# EAGLE design blinkenspiel (EAGLE 5.09)
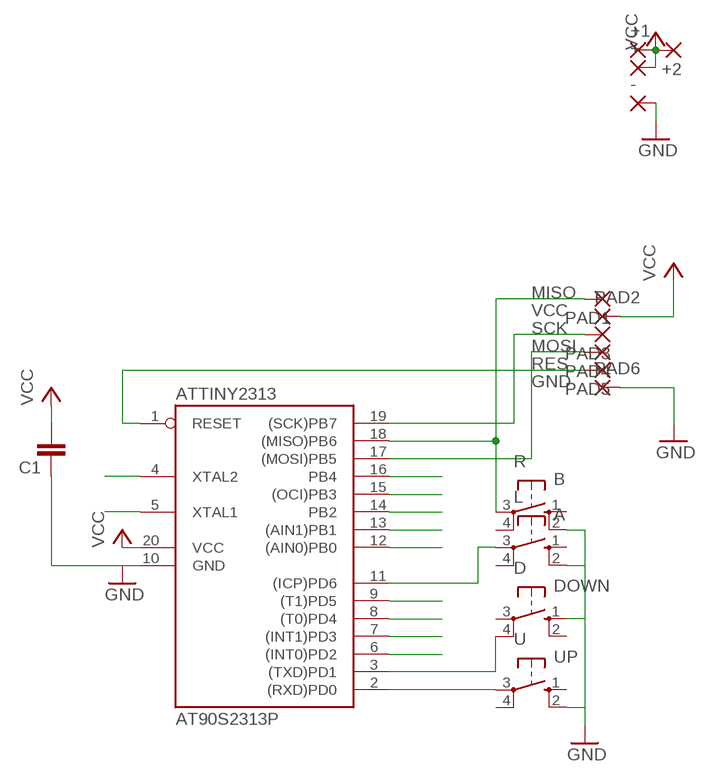
[diagram p0: schematic, sheet 1]

## Parts
+  SMD2  [SMD1,27-2,54]
+1  SMD2  [SMD1,27-2,54]
+2  SMD2  [SMD1,27-2,54]
-  SMD2  [SMD1,27-2,54]
ATTINY2313  AT90S2313P  [DIL20]
C1  C-EU025-024X044  [C025-024X044]
D  DOWN  10-XX  [B3F-10XX]
L  A  10-XX  [B3F-10XX]
PAD1  SMD2  [SMD1,27-2,54]
PAD2  SMD2  [SMD1,27-2,54]
PAD3  SMD2  [SMD1,27-2,54]
PAD4  SMD2  [SMD1,27-2,54]
PAD5  SMD2  [SMD1,27-2,54]
PAD6  SMD2  [SMD1,27-2,54]
R  B  10-XX  [B3F-10XX]
U  UP  10-XX  [B3F-10XX]

## Nets
4: ATTINY2313.4(XTAL2)
5: ATTINY2313.5(XTAL1)
6: ATTINY2313.6((INT0)PD2)
7: ATTINY2313.7((INT1)PD3)
8: ATTINY2313.8((T0)PD4)
9: ATTINY2313.9((T1)PD5)
12: ATTINY2313.12((AIN0)PB0)
13: ATTINY2313.13((AIN1)PB1)
14: ATTINY2313.14(PB2)
15: ATTINY2313.15((OCI)PB3)
16: ATTINY2313.16(PB4)
17: ATTINY2313.17((MOSI)PB5) PAD4.1(P)
GND: -.1(P) ATTINY2313.10(GND) C1.1 D.1(S) L.2(S1) PAD6.1(P) R.2(S1) U.2(S1)
N$1: ATTINY2313.11((ICP)PD6) L.3(P)
N$2: ATTINY2313.3((TXD)PD1) D.4(P1)
N$3: ATTINY2313.2((RXD)PD0) U.3(P)
N$4: ATTINY2313.18((MISO)PB6) PAD1.1(P) R.3(P)
N$7: ATTINY2313.19((SCK)PB7) PAD3.1(P)
RES: ATTINY2313.1(RESET) PAD5.1(P)
VCC: +1.1(P) +2.1(P) +.1(P) ATTINY2313.20(VCC) C1.2 PAD2.1(P)
Unconnected: D.2(S1) D.3(P) L.1(S) L.4(P1) R.1(S) R.4(P1) U.1(S) U.4(P1)

## Notes on the sheet
- MISO
- VCC
- SCK
- MOSI
- RES
- GND

## Library data of the parts
+ +1 +2 - PAD1-PAD6 = wirepad:SMD2: SMD PAD
ATTINY2313 = atmel:AT90S2313: MICROCONTROLLER 2 Kbytes FLASH 128 bytes SRAM 128 bytes EEPROM UART
C1 = resistor:C-EU: CAPACITOR, European symbol
D L R U = switch-omron:10-XX: OMRON SWITCH

## Board
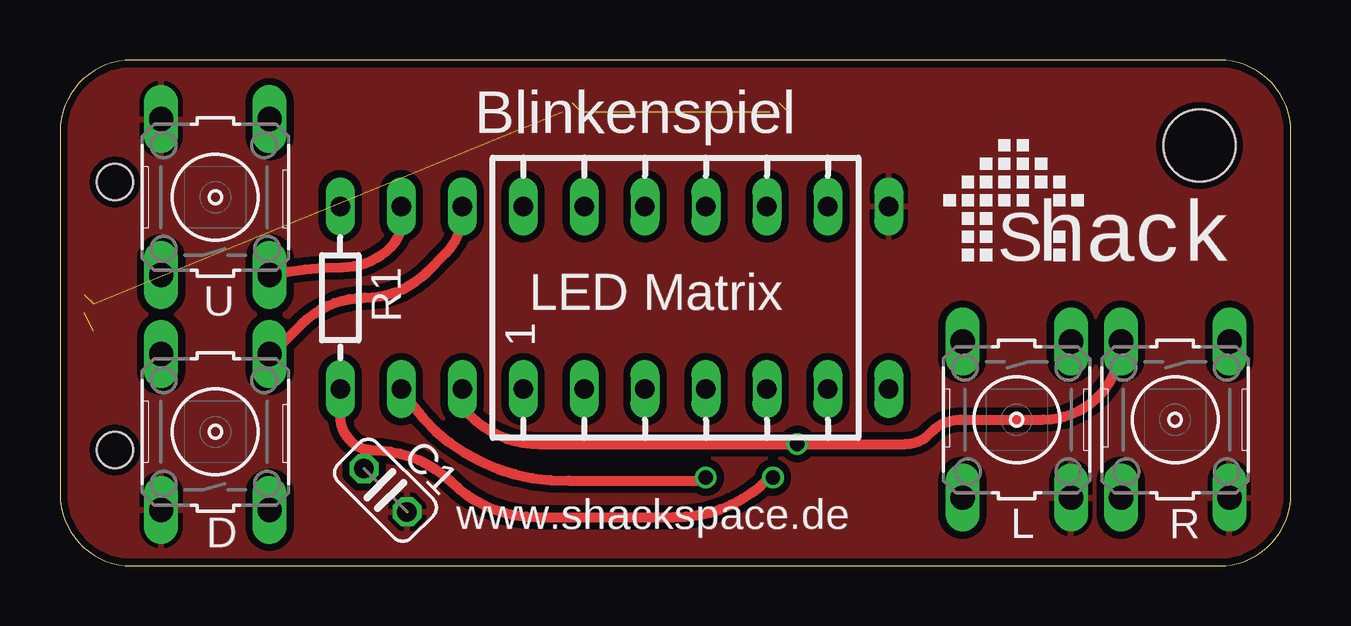
[diagram p1: board, top side]
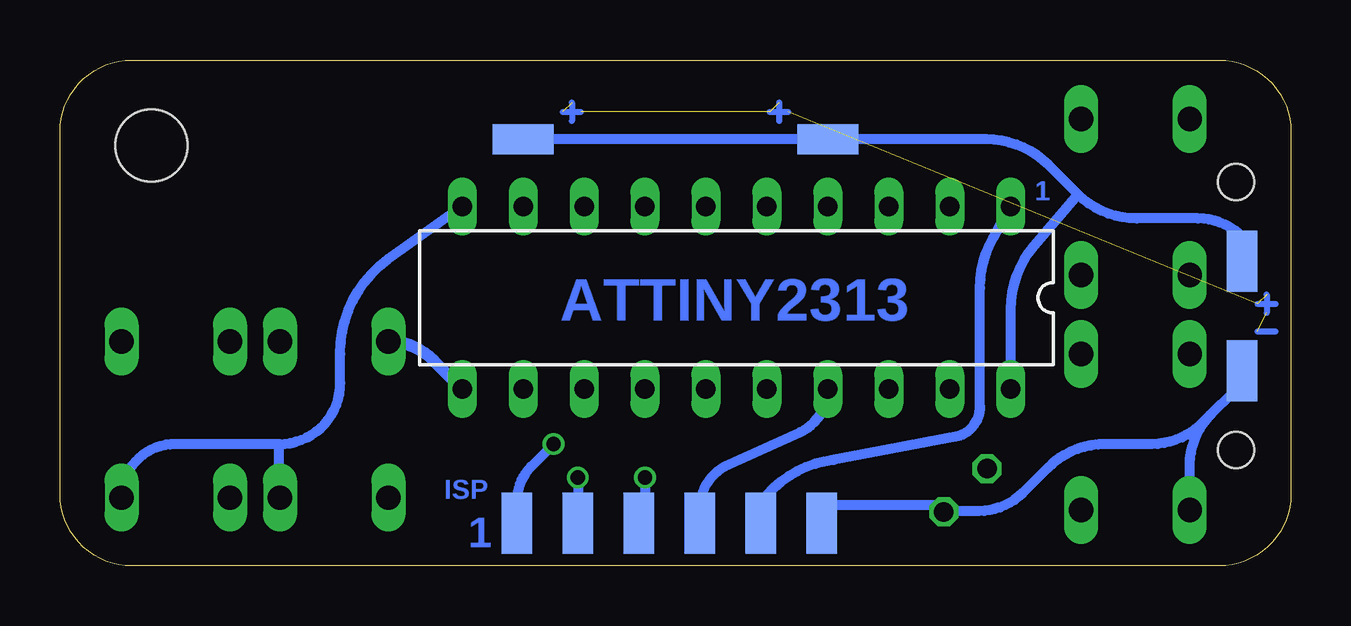
[diagram p2: board, bottom side, seen from below]

Size 51.31 x 21.08 mm. Coordinates in mm from the lower left corner, seen from the top.
Outline: 3,21.08 arc90 0,18.08 0,3 arc90 3,0 48.31,0 arc90 51.31,3 51.31,18.08 arc90 48.31,21.08 3,21.08
Copper layers (1*16): Top 0.035mm / dielectric 1.5mm / Bottom 0.035mm
Design rules "PCB-POOL Standard": minimum track width 0.15mm, minimum drill 0.3mm, track to track 0.15mm, track to pad 0.15mm, pad to pad 0.15mm, via to via 0.15mm, smd to smd 0.15mm, copper to edge 0.3mm, drill to drill 0.2mm, minimum pad ring 0.2mm, minimum via ring 0.15mm, stop-mask expansion 0.075mm, vias tented up to drill 0mil, thermal gap 0.2mm
Holes 3 mm at 47.5,17.53
Holes 1.5 mm at 2.29,4.83 2.29,16
Milling: 8 lines

### Footprints (pad centres in the part's own frame; a part is rotated, then mirrored left to right if it is on the bottom)
SMD1,27-2,54 = smd 1.27 x 2.54: 1 0,0
DIL20 = drill 0.813 long: 1 -11.43,-3.81; 2 -8.89,-3.81; 3 -6.35,-3.81; 4 -3.81,-3.81; 5 -1.27,-3.81; 6 1.27,-3.81; 7 3.81,-3.81; 8 6.35,-3.81; 9 8.89,-3.81; 10 11.43,-3.81; 11 11.43,3.81; 12 8.89,3.81; 13 6.35,3.81; 14 3.81,3.81; 15 1.27,3.81; 16 -1.27,3.81; 17 -3.81,3.81; 18 -6.35,3.81; 19 -8.89,3.81; 20 -11.43,3.81
C025-024X044 = drill 0.813 octagon: 1 -1.27,0; 2 1.27,0
B3F-10XX = drill 1.016 long: 1 -3.251,2.261; 2 3.251,2.261; 3 -3.251,-2.261; 4 3.251,-2.261

### Placement (x,y rotation side)
+  2.03,12.7 180 bottom
+1  32,17.78 90 bottom
+2  19.3,17.78 90 bottom
-  2.03,8.13 180 bottom
ATTINY2313  23.11,11.18 180 bottom
C1  13.57,3.15 135 top
D  6.48,5.59 90 top
L  39.88,6.1 270 top
PAD1  32.26,1.78 0 bottom
PAD2  29.72,1.78 0 bottom
PAD3  27.18,1.78 0 bottom
PAD4  24.64,1.78 0 bottom
PAD5  22.1,1.78 0 bottom
PAD6  19.56,1.78 0 bottom
R  46.48,6.1 270 top
U  6.48,15.37 90 top

### Tracks (layer width: path | path; a pad name or v marks a point on that pad's centre or on a via)
17
  Bottom 0.406: PAD4.1 24.64,2.37 arc60 23.61,4.15 20.46,5.57 arc-66 ATTINY2313.17
GND
  Bottom 0.406: 3.34,6.31 arc-45 4.22,4.19 D.1 | 3.34,6.31 2.39,7.26 arc-45 -.1 | 3.34,6.31 3.69,5.96 arc45 5.82,5.08 7.73,5.08 arc-45 10.14,4.08 11.17,3.05 arc45 13.02,2.29 13.84,2.29 arc45 14.45,2.54 19.3,2.54 arc-45 19.56,1.93 PAD6.1 | L.2 arc45 42.16,2.91 42.16,5.08 | 42.16,5.08 46.51,5.08 arc-90 R.2 | ATTINY2313.10 37.65,12.78 arc-53 39.62,8.84 39.62,7.62 arc90 42.16,5.08
  pour Top (isolate 0.305): 48.31,21.08 arc-90 51.31,18.08 51.31,3 arc-90 48.31,0 3,0 arc-90 0,3 0,18.08 arc-90 3,21.08
N$1
  Bottom 0.508: ATTINY2313.11 35.75,8.57 arc-45 L.3
N$2
  Top 0.406: D.4 arc45 8.91,8.91 10.09,10.09 arc-45 12.71,11.18 arc45 15.3,12.25 16.1,13.05 arc45 16.76,14.66 ATTINY2313.3
N$3
  Top 0.406: ATTINY2313.2 14.22,14.31 arc-45 13.8,13.29 arc-45 11.75,12.45 arc12 U.3
N$4  (via drill 0.6)
  Top 0.406: 16.76,7.33 ATTINY2313.18 16.76,6.6 17.09,6.28 arc45 19.98,5.08 v30.73,5.08 35.25,5.08 arc45 36.22,5.48 36.33,5.6 arc-45 37.54,6.1 40.97,6.1 arc90 R.3
  Bottom 0.406: v30.73,5.08 31.68,4.14 arc-45 32.26,2.73 PAD1.1
N$6  (6 unrouted)
  Bottom 0.254: 1.4,10.92 0.64,10.92 | 1.4,9.78 0.64,9.78 | 21.72,18.92 20.95,18.92 | 30.35,18.92 29.59,18.92 | 29.97,19.3 29.97,18.54 | 21.34,19.3 21.34,18.54 | 1.02,11.3 1.02,10.54
N$7  (via drill 0.6)
  Top 0.406: ATTINY2313.19 arc60 21.2,3.56 26.87,3.56 26.92,3.61 v26.92,3.68
  Bottom 0.406: PAD3.1 26.92,2.03 v26.92,3.68
RES
  Bottom 0.406: ATTINY2313.1 12.41,13.68 arc-29 12.95,11.58 12.95,6.63 arc79 13.98,5.39 19.05,4.42 arc-47 22.1,2.64 PAD5.1
VCC  (via drill 0.6)
  Top 0.406: v29.72,3.68 29.59,3.68 arc-45 25.61,2.03 19.88,2.03 arc-45 16.3,3.52 arc44 12.95,4.83 | 12.95,4.83 arc-90 11.68,6.35 ATTINY2313.20 | 12.95,4.83 arc90 12.67,4.29 C1.2
  Bottom 0.406: +.1 2.03,13.72 arc-45 3.87,14.48 6.44,14.48 arc45 8.89,15.49 | 8.89,15.49 10.71,13.34 arc-40 11.68,10.69 ATTINY2313.20 | 8.89,15.49 10.09,16.7 arc-45 12.71,17.78 +2.1 +1.1 | v29.72,3.68 PAD2.1

### Text on the board
Bottom: 1 | ISP | 1
tNames: Blinkenspiel | S | h | a | c | k | LED Matrix | R1 | 1 | www.shackspace.de